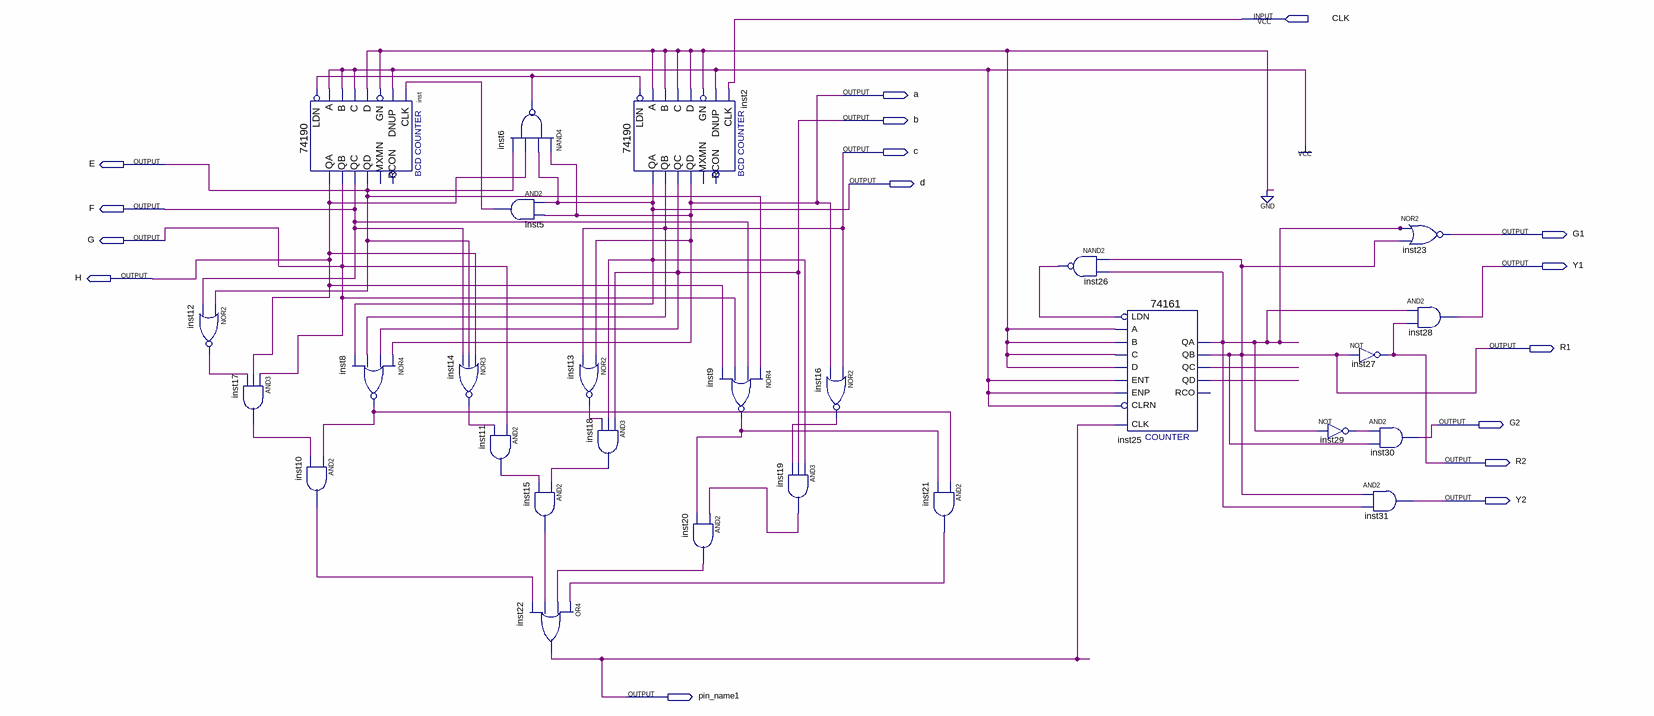
[diagram p0: schematic sheet]
// Quartus schematic si.bdf as structural Verilog: 27 symbols, 16 pins
module si (
  input  CLK,
  output a,
  output b,
  output c,
  output E,
  output d,
  output F,
  output G1,
  output G,
  output Y1,
  output H,
  output R1,
  output G2,
  output R2,
  output Y2,
  output pin_name1
);

  wire inst5_out, inst6_out, inst8_out, inst9_out, inst10_out, inst11_out, inst12_out, inst13_out,
       inst14_out, inst15_out, inst16_out, inst17_out, inst18_out, inst19_out, inst20_out, inst21_out,
       inst25_qa, inst25_qc, inst25_qd, inst26_out, inst29_out;

  nor inst12 (inst12_out, E, F);
  and inst17 (inst17_out, G, H, inst12_out);
  \74190  inst (
    .LDN(inst6_out), .A(1'b1), .C(1'b1), .B(1'b1), .D(1'b0), .GN(1'b0), .CLK(inst5_out), .DNUP(1'b1), .QA(H),
    .QB(G), .QD(E), .QC(F));  // open: MXMN, RCON
  and inst10 (inst10_out, inst8_out, inst17_out);
  nor inst8 (inst8_out, a, b, c, d);
  nor inst14 (inst14_out, H, E, F);
  nand inst6 (inst6_out, a, d, H, E);
  and inst5 (inst5_out, d, a);
  and inst11 (inst11_out, G, inst14_out);
  and inst15 (inst15_out, inst18_out, inst11_out);
  or inst22 (pin_name1, inst21_out, inst20_out, inst15_out, inst10_out);
  nor inst13 (inst13_out, a, c);
  \74190  inst2 (
    .LDN(inst6_out), .A(1'b0), .C(1'b0), .B(1'b0), .D(1'b0), .GN(1'b0), .CLK(CLK), .DNUP(1'b1), .QA(d),
    .QB(c), .QD(a), .QC(b));  // open: MXMN, RCON
  and inst18 (inst18_out, b, d, inst13_out);
  nor inst9 (inst9_out, E, F, G, H);
  and inst20 (inst20_out, inst19_out, inst9_out);
  and inst19 (inst19_out, d, b, inst16_out);
  nor inst16 (inst16_out, c, a);
  and inst21 (inst21_out, inst8_out, inst9_out);
  nand inst26 (inst26_out, R1, inst25_qa);
  \74161  inst25 (
    .CLRN(1'b1), .CLK(pin_name1), .ENP(1'b1), .LDN(inst26_out), .A(1'b0), .D(1'b0), .ENT(1'b1), .B(1'b0),
    .C(1'b0), .QD(inst25_qd), .QC(inst25_qc), .QB(R1), .QA(inst25_qa));  // open: RCO
  not inst29 (inst29_out, inst25_qa);
  not inst27 (R2, R1);
  and inst30 (G2, inst29_out, R1);
  and inst31 (Y2, R1, inst25_qa);
  nor inst23 (G1, inst25_qa, R1);
  and inst28 (Y1, inst25_qa, R2);
endmodule
